# Altium project Bhishma_Slave.PrjPcb
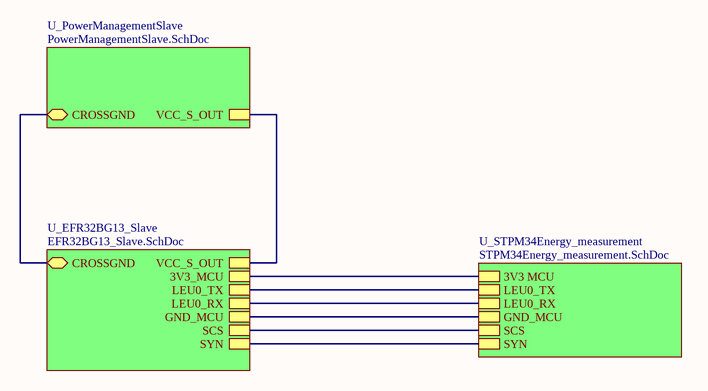
[diagram p0: Slave_Block.SchDoc]
4 sheets, 95 parts. Net scope: hierarchical (ports join the sheet entries above them; power ports are global).
Board file: Bhishma_SlaveLayout.PcbDoc
Sheets:
  Slave_Block.SchDoc
    U_EFR32BG13_Slave = EFR32BG13_Slave.SchDoc
    U_PowerManagementSlave = PowerManagementSlave.SchDoc
    U_STPM34Energy_measurement = STPM34Energy_measurement.SchDoc

## Sheet Slave_Block.SchDoc: Slave Block Diagram
size A4; Organization: University of Colorado; Address1: Boulder; Address2: Bhishma; Address3: Low Power Embedded; Address4: Design Techniques; SheetNumber: 3; SheetTotal: 9

### Sub-sheets
U_EFR32BG13_Slave = EFR32BG13_Slave.SchDoc: LEU0_TX, LEU0_RX, SCS, SYN, GND_MCU, 3V3_MCU, VCC_S_OUT, CROSSGND
U_PowerManagementSlave = PowerManagementSlave.SchDoc: VCC_S_OUT, CROSSGND
U_STPM34Energy_measurement = STPM34Energy_measurement.SchDoc: 3V3 MCU, LEU0_TX, LEU0_RX, GND_MCU, SCS, SYN

### Nets
BGND: sheet U_EFR32BG13_Slave/GND_MCU, sheet U_EFR32BG13_Slave/CROSSGND, sheet U_PowerManagementSlave/CROSSGND, sheet U_STPM34Energy_measurement/GND_MCU
IOVDD: sheet U_EFR32BG13_Slave/3V3_MCU, sheet U_STPM34Energy_measurement/3V3 MCU
PA2: sheet U_EFR32BG13_Slave/LEU0_RX, sheet U_STPM34Energy_measurement/LEU0_RX
PA3: sheet U_EFR32BG13_Slave/LEU0_TX, sheet U_STPM34Energy_measurement/LEU0_TX
PA4: sheet U_EFR32BG13_Slave/SCS, sheet U_STPM34Energy_measurement/SCS
PA5: sheet U_EFR32BG13_Slave/SYN, sheet U_STPM34Energy_measurement/SYN
NetC33_2: sheet U_EFR32BG13_Slave/VCC_S_OUT, sheet U_PowerManagementSlave/VCC_S_OUT

### Notes on the sheet
- Title
- Size:
- Date:
- A4
- Number:
- Time:
- Revision:
- Sheet
- of
- File:

## Sheet EFR32BG13_Slave.SchDoc: EFR32BG13 Blue Gecko Slave
size A4; Author: Sarthak Jain; DrawnBy: Sarthak Jain; Engineer: Sarthak Jain; Organization: University of Colorado; Address1: Boulder; Address2: Bhishma; Address3: Low Power Embedded; Address4: Design Techniques; Revision: 0.1; SheetNumber: 8; SheetTotal: 9; ProjectName: Bhishma
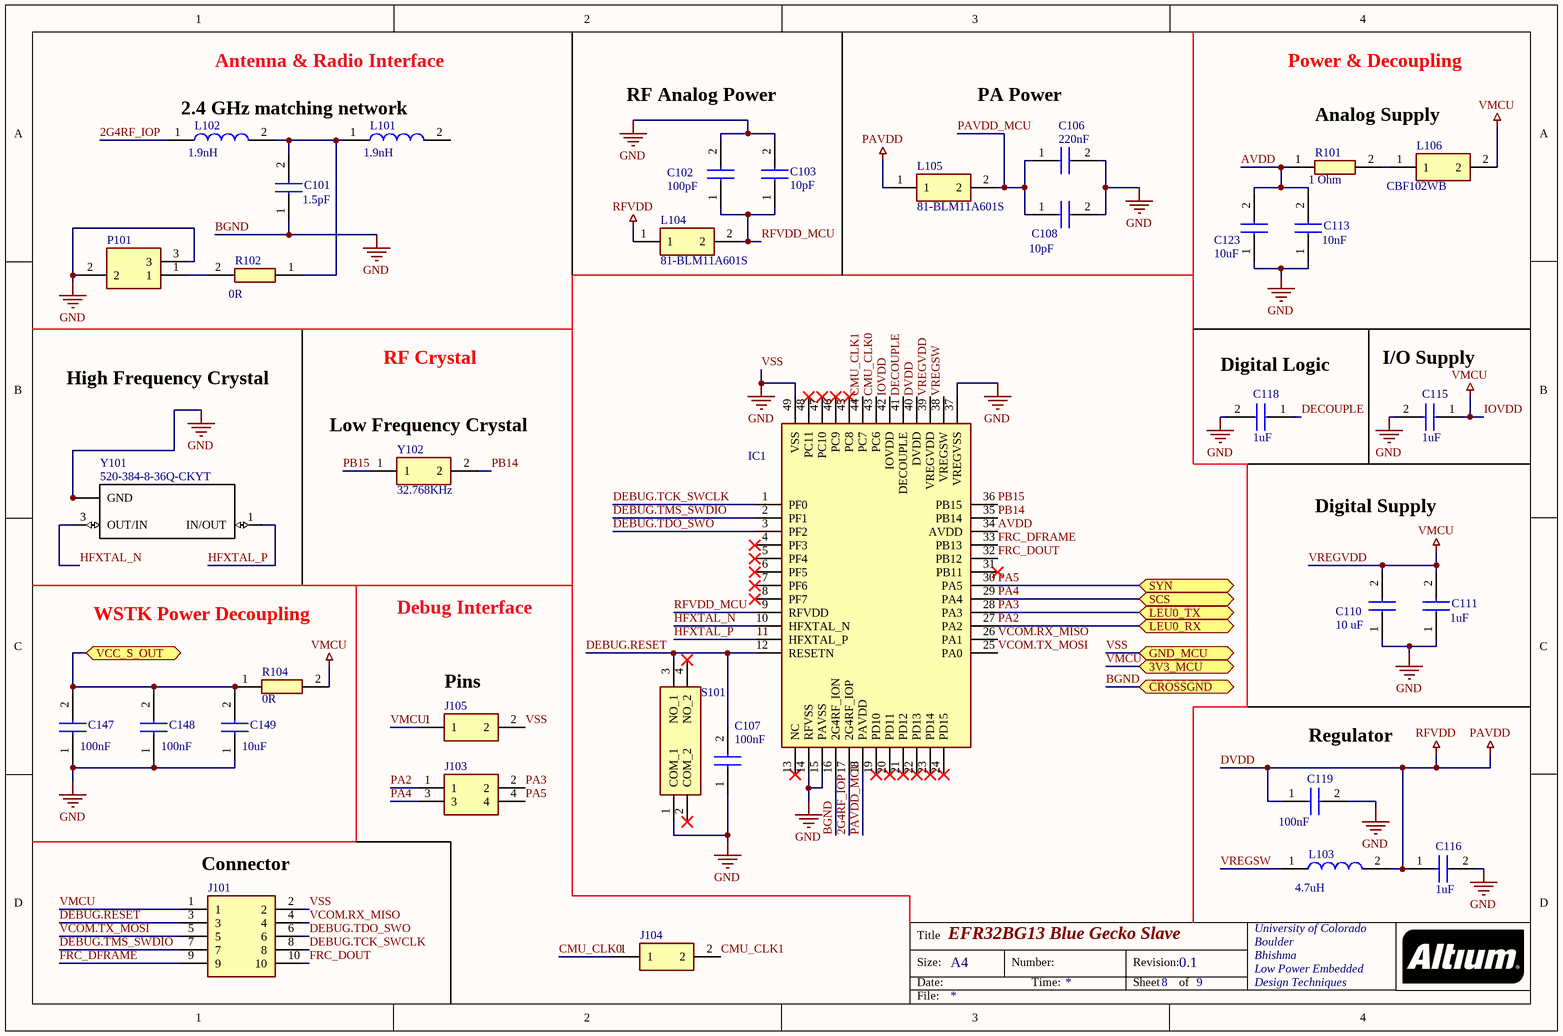
[diagram p1: EFR32BG13_Slave.SchDoc]

### Parts
C101  value 1.5pF  [CAPC1608X90N]
C102  value 100pF  [CAPC1608X90N]  (hidden comment: 81-GCG1885G1H101JA1D)
C103  value 10pF  [CAPC1608X90N]  (hidden comment: 81-GCG1885G1H100JA1D)
C106  value 220nF  [CAPC1608X90N]  (hidden comment: 81-GCM188R71E224K55D)
C107  value 100nF  [CAPC1608X90N]  (hidden comment: 581-0603YC104JAT4A)
C108  value 10pF  [CAPC1608X90N]  (hidden comment: 81-GCG1885G1H100JA1D)
C110  value 10 uF  [CAPC1608X90N]  (hidden comment: 81-GRM188R61E106KA3D)
C111  value 1uF  [CAPC1608X90N]  (hidden comment: 81-GCM188R71C105K64D)
C113  value 10nF  [CAPC1608X90N]  (hidden comment: 81-GCM1887U1H103JA6J)
C115  value 1uF  [CAPC1608X90N]  (hidden comment: 81-GCM188R71C105K64D)
C116  value 1uF  [CAPC1608X90N]  (hidden comment: 81-GCM188R71C105K64D)
C118  value 1uF  [CAPC1608X90N]  (hidden comment: 81-GCM188R71C105K64D)
C119  value 100nF  [CAPC1608X90N]  (hidden comment: 581-0603YC104JAT4A)
C123  value 10uF  [CAPC1608X90N]  (hidden comment: 81-GRM188R61E106KA3D)
C147  value 100nF  [CAPC1608X90N]  (hidden comment: 581-0603YC104JAT4A)
C148  value 100nF  [CAPC1608X90N]  (hidden comment: 581-0603YC104JAT4A)
C149  value 10uF  [CAPC1608X90N]  (hidden comment: 81-GRM188R61E106KA3D)
IC1  634-BGP632F512GM48D  [QFN50P700X700X90-49N-D]  (value not drawn)
J101  200-FTSH10501FDVK  [SAMTEC_FTSH-105-01-L-DV]  (value not drawn)
J103  538-87898-0424  [878980424]  (value not drawn)
J104  538-87898-0204  [878980204]  (value not drawn)
J105  538-87898-0204  [878980204]  (value not drawn)
L101  value 1.9nH  [LQP03TQ0N6B02D]
L102  value 1.9nH  [LQP03TQ0N6B02D]
L103  value 4.7uH  [INDC1608X95N]  (hidden comment: 810-KLZ1608MHR4R7WTD)
L104  81-BLM11A601S  [BEADC1608X95N]
L105  81-BLM11A601S  [BEADC1608X95N]
L106  value CBF102WB  [BEADC1608X100N]  (hidden comment: 710-74279266)
P101  798-U.FL-R-SMT-110  [U.FL-R-SMT-1(10)]  (value not drawn)
R101  value 1 Ohm  [RESC1608X55N]  (hidden comment: 279-CRGS0603J1R0)
R102  value 0R  [RESC3216X60N]  (hidden comment: 71-CRCW12060000Z0EAC)
R104  value 0R  [RESC3216X60N]  (hidden comment: 71-CRCW12060000Z0EAC)
S101  612-LL3301AF065QJ  [LL3301FF065QJ]  (value not drawn)
Y101  520-384-8-36Q-CKYT  [*XTAL_ECS-384-8-36Q-CKY-TR]
Y102  value 32.768KHz  [CM8V32768TA020125]  (hidden comment: 428-201410-MC01)

### Ports
3V3_MCU, CROSSGND, GND_MCU, LEU0_RX, LEU0_TX, SCS, SYN, VCC_S_OUT

### Nets
BGND: C101.1 C102.2 C103.2 C106.2 C107.1 C108.2 C110.1 C111.1 C113.1 C115.2 C116.2 C118.2 C119.2 C123.1 C147.1 C148.1 C149.1 IC1.14(RFVSS) IC1.15(PAVSS) IC1.16(2G4RF_ION) IC1.37(VREGVSS) IC1.49(VSS) J101.2 J105.2 P101.2 P101.3 S101.1(COM_1) Y101.2(GND) Y101.4(GND) ; port GND_MCU, port CROSSGND  [also labelled GND, VSS]
DVDD: C116.1 C119.1 IC1.40(DVDD) L103.2 L104.1 L105.1  [also labelled PAVDD, RFVDD]
IOVDD: C110.2 C111.2 C115.1 IC1.39(VREGVDD) IC1.42(IOVDD) J101.1 J105.1 L106.2 R104.2 ; port 3V3_MCU  [also labelled VMCU, VREGVDD]
2G4RF_IOP: IC1.17(2G4RF_IOP) L102.1
AVDD: C113.2 C123.2 IC1.34(AVDD) R101.1
CMU_CLK0: IC1.43(PC6) J104.1
CMU_CLK1: IC1.44(PC7) J104.2
DEBUG.RESET: C107.2 IC1.12(RESETN) J101.3 S101.3(NO_1)
DEBUG.TCK_SWCLK: IC1.1(PF0) J101.8
DEBUG.TDO_SWO: IC1.3(PF2) J101.6
DEBUG.TMS_SWDIO: IC1.2(PF1) J101.7
DECOUPLE: C118.1 IC1.41(DECOUPLE)
FRC_DFRAME: IC1.33(PB13) J101.9
FRC_DOUT: IC1.32(PB12) J101.10
HFXTAL_N: IC1.10(HFXTAL_N) Y101.3(OUT/IN)
HFXTAL_P: IC1.11(HFXTAL_P) Y101.1(IN/OUT)
PA2: IC1.27(PA2) J103.1 ; port LEU0_RX
PA3: IC1.28(PA3) J103.2 ; port LEU0_TX
PA4: IC1.29(PA4) J103.3 ; port SCS
PA5: IC1.30(PA5) J103.4 ; port SYN
PAVDD_MCU: C106.1 C108.1 IC1.18(PAVDD) L105.2
PB14: IC1.35(PB14) Y102.2
PB15: IC1.36(PB15) Y102.1
RFVDD_MCU: C102.1 C103.1 IC1.9(RFVDD) L104.2
VCOM.RX_MISO: IC1.26(PA1) J101.4
VCOM.TX_MOSI: IC1.25(PA0) J101.5
VREGSW: IC1.38(VREGSW) L103.1
NetC33_2: C147.2 C148.2 C149.2 R104.1 ; port VCC_S_OUT
NetC101_2: C101.2 L101.1 L102.2 R102.1
NetL106_1: L106.1 R101.2
NetP101_1: P101.1 R102.2

Not connected (* = marked no-connect by the designer): IC1 4(PF3)* 5(PF4)* 6(PF5)* 7(PF6)* 8(PF7)* 13(NC)* 19(PD10)* 20(PD11)* 21(PD12)* 22(PD13)* 23(PD14)* 24(PD15)* 31(PB11)* 45(PC8)* 46(PC9)* 47(PC10)* 48(PC11)*; L101 2; S101 2(COM_2)* 4(NO_2)*

### Notes on the sheet
- 2.4 GHz matching network
- Antenna & Radio Interface
- RF Analog Power
- PA Power
- Power & Decoupling
- Analog Supply
- High Frequency Crystal
- RF Crystal
- (near C118) Digital Logic
- (near C115) I/O Supply
- (near Y102) Low Frequency Crystal
- Digital Supply
- WSTK Power Decoupling
- Debug Interface
- (near J105) Pins
- Regulator
- (near J101) Connector
- Title
- Size:
- Date:
- A4
- Number:
- Time:
- Revision:
- Sheet
- of
- File:

### Library data of the parts
C101 = GRM1885C1H1R5CA01D: Capacitor; Manufacturer_Name: Murata Electronics; Datasheet Link: http://www.murata.com/~/media/webrenewal/support/library/catalog/products/capacitor/mlcc/c02e.pdf; Height: 0.9mm; Manufacturer_Part_Number: GRM1885C1H1R5CA01D; RS Part Number: 7769236; RS Price/Stock: https://uk.rs-online.com/web/p/products/7769236
C102 = GCG1885G1H101JA01D: Capacitor; Manufacturer_Name: Murata Electronics; Datasheet Link: https://psearch.en.murata.com/capacitor/product/GCG1885G1H101JA01%23.html; Height: 0.9mm; Manufacturer_Part_Number: GCG1885G1H101JA01D; Mouser Part Number: 81-GCG1885G1H101JA1D; Mouser Price/Stock: https://www.mouser.com/Search/Refine.aspx?Keyword=81-GCG1885G1H101JA1D
C103 C108 = GCG1885G1H100JA01D: Capacitor; Manufacturer_Name: Murata Electronics; Datasheet Link: https://psearch.en.murata.com/capacitor/product/GCG1885G1H100JA01%23.html; Height: 0.9mm; Manufacturer_Part_Number: GCG1885G1H100JA01D; Mouser Part Number: 81-GCG1885G1H100JA1D; Mouser Price/Stock: https://www.mouser.com/Search/Refine.aspx?Keyword=81-GCG1885G1H100JA1D
C106 = GCM188R71E224KA55D: Capacitor; Manufacturer_Name: Murata Electronics; Datasheet Link: https://psearch.en.murata.com/capacitor/product/GCM188R71E224KA55%23.html; Height: 0.9mm; Manufacturer_Part_Number: GCM188R71E224KA55D; Mouser Part Number: 81-GCM188R71E224K55D; Mouser Price/Stock: https://www.mouser.com/Search/Refine.aspx?Keyword=81-GCM188R71E224K55D; RS Part Number: 7234976P; RS Price/Stock: http://uk.rs-online.com/web/p/products/7234976P
C107 C119 C147 C148 = 0603YC104JAT4A: Capacitor; Manufacturer_Name: AVX; Datasheet Link: https://componentsearchengine.com/Datasheets/1/06031A100FAT2A.pdf; Height: 0.9mm; Manufacturer_Part_Number: 0603YC104JAT4A; Mouser Part Number: 581-0603YC104JAT4A; Mouser Price/Stock: https://www.mouser.com/Search/Refine.aspx?Keyword=581-0603YC104JAT4A
C110 C123 C149 = GRM188R61E106KA73D: Capacitor; Manufacturer_Name: Murata Electronics; Datasheet Link: http://componentsearchengine.com/Datasheets/1/GRM188R61E106KA73D.pdf; Height: 0.9mm; Manufacturer_Part_Number: GRM188R61E106KA73D; Mouser Part Number: 81-GRM188R61E106KA3D; Mouser Price/Stock: https://www.mouser.com/Search/Refine.aspx?Keyword=81-GRM188R61E106KA3D
C111 C115 C116 C118 = GCM188R71C105KA64D: Capacitor; Manufacturer_Name: Murata Electronics; Datasheet Link: https://psearch.en.murata.com/capacitor/product/GCM188R71C105KA64%23.html; Height: 0.9mm; Manufacturer_Part_Number: GCM188R71C105KA64D; Mouser Part Number: 81-GCM188R71C105K64D; Mouser Price/Stock: https://www.mouser.com/Search/Refine.aspx?Keyword=81-GCM188R71C105K64D; RS Part Number: 7900562P; RS Price/Stock: http://uk.rs-online.com/web/p/products/7900562P
C113 = GCM1887U1H103JA16J: Capacitor; Manufacturer_Name: Murata Electronics; Datasheet Link: https://psearch.en.murata.com/capacitor/product/GCM1887U1H103JA16%23.html; Height: 0.9mm; Manufacturer_Part_Number: GCM1887U1H103JA16J; Mouser Part Number: 81-GCM1887U1H103JA6J; Mouser Price/Stock: https://www.mouser.com/Search/Refine.aspx?Keyword=81-GCM1887U1H103JA6J
IC1 = EFR32BG13P632F512GM48-D: Integrated Circuit; Manufacturer_Name: Silicon Labs; Datasheet Link: https://componentsearchengine.com/Datasheets/1/EFR32BG13P632F512GM48-D.pdf; Height: 0.9mm; Manufacturer_Part_Number: EFR32BG13P632F512GM48-D; Mouser Part Number: 634-BGP632F512GM48D; Mouser Price/Stock: https://www.mouser.com/Search/Refine.aspx?Keyword=634-BGP632F512GM48D
J101 = FTSH-105-01-F-DV-K: Connector; Manufacturer_Name: SAMTEC; Datasheet Link: http://suddendocs.samtec.com/prints/ftsh-1xx-xx-xxx-dv-xxx-xxx-mkt.pdf; Manufacturer_Part_Number: FTSH-105-01-F-DV-K; Mouser Part Number: 200-FTSH10501FDVK; Mouser Price/Stock: https://www.mouser.com/Search/Refine.aspx?Keyword=200-FTSH10501FDVK; RS Part Number: 1592372; RS Price/Stock: http://uk.rs-online.com/web/p/products/1592372
J103 = 87898-0424: Connector; Manufacturer_Name: Molex; Allied_Number: 71465829; Datasheet Link: https://componentsearchengine.com/Datasheets/1/87898-0424.pdf; Height: 9.65mm; Manufacturer_Part_Number: 87898-0424; Mouser Part Number: 538-87898-0424; Mouser Price/Stock: https://www.mouser.com/Search/Refine.aspx?Keyword=538-87898-0424; Allied Price/Stock: https://www.alliedelec.com/molexincorporated-87898-0424/71465829/
J104 J105 = 87898-0204: Connector; Manufacturer_Name: Molex; Allied_Number: 70967354; Datasheet Link: https://www.molex.com/pdm_docs/sd/878980204_sd.pdf; Height: 8.33mm; Manufacturer_Part_Number: 87898-0204; Mouser Part Number: 538-87898-0204; Mouser Price/Stock: https://www.mouser.com/Search/Refine.aspx?Keyword=538-87898-0204; Allied Price/Stock: https://www.alliedelec.com/molex-incorporated-87898-0204/70967354/
L101 L102 = LQP03TQ1N9C02D: Inductor; Manufacturer_Name: Murata Electronics; Datasheet Link: https://psearch.en.murata.com/inductor/product/LQP03TQ1N9C02%23.html; Height: 0.6mm; Manufacturer_Part_Number: LQP03TQ1N9C02D
L103 = KLZ1608MHR4R7WTD25: Inductor; Manufacturer_Name: TDK; Datasheet Link: http://www.mouser.com/datasheet/2/400/nductor_automotive_decoupling_klz1608-hr_en-1108665.pdf; Height: 0.95mm; Manufacturer_Part_Number: KLZ1608MHR4R7WTD25; Mouser Part Number: 810-KLZ1608MHR4R7WTD; Mouser Price/Stock: https://www.mouser.com/Search/Refine.aspx?Keyword=810-KLZ1608MHR4R7WTD
L104 L105 = BLM18AG601SN1D: Filter; Manufacturer_Name: Murata Electronics; Datasheet Link: https://www.murata.com/en-us/products/productdetail?partno=BLM18AG601SN1%23; Height: 0.95mm; Manufacturer_Part_Number: BLM18AG601SN1D; Mouser Part Number: 81-BLM11A601S; Mouser Price/Stock: https://www.mouser.com/Search/Refine.aspx?Keyword=81-BLM11A601S; RS Part Number: 0110380; RS Price/Stock: http://uk.rs-online.com/web/p/products/0110380
L106 = 74279266: Ferrite Bead; Manufacturer_Name: Wurth Elektronik; Datasheet Link: http://uk.rs-online.com/web/p/products/3674856; Height: 1mm; Manufacturer_Part_Number: 74279266; Mouser Part Number: 710-74279266; Mouser Price/Stock: https://www.mouser.com/Search/Refine.aspx?Keyword=710-74279266; RS Part Number: 1241858P; RS Price/Stock: http://uk.rs-online.com/web/p/products/1241858P
P101 = U.FL-R-SMT-1(10): Connector; Manufacturer_Name: Hirose; Datasheet Link: https://www.hirose.com/product/en/download_file/key_name/U.FL-R-SMT-1%2810%29/category/Drawing%20(2D)/doc_file_id/37627/?file_category_id=6&item_id=03310472210&is_series=; Manufacturer_Part_Number: U.FL-R-SMT-1(10); Mouser Part Number: 798-U.FL-R-SMT-110; Mouser Price/Stock: https://www.mouser.com/Search/Refine.aspx?Keyword=798-U.FL-R-SMT-110; RS Part Number: 0557981; RS Price/Stock: http://uk.rs-online.com/web/p/products/0557981
R101 = CRGS0603J1R0: Resistor; Manufacturer_Name: TE Connectivity; Datasheet Link: http://www.te.com/commerce/DocumentDelivery/DDEController?Action=showdoc&DocId=Data+Sheet%7F9-1773463-8%7FB%7Fpdf%7FEnglish%7FENG_DS_9-1773463-8_B.pdf%7F3-2176243-7; Height: 0.55mm; Manufacturer_Part_Number: CRGS0603J1R0; Mouser Part Number: 279-CRGS0603J1R0; Mouser Price/Stock: https://www.mouser.com/Search/Refine.aspx?Keyword=279-CRGS0603J1R0; RS Part Number: 9044983P; RS Price/Stock: http://uk.rs-online.com/web/p/products/9044983P
R102 R104 = CRCW12060000Z0EAC: Resistor; Manufacturer_Name: Vishay; Datasheet Link: http://componentsearchengine.com/Datasheets/1/CRCW12060000Z0EAC.pdf; Height: 0.6mm; Manufacturer_Part_Number: CRCW12060000Z0EAC; Mouser Part Number: 71-CRCW12060000Z0EAC; Mouser Price/Stock: https://www.mouser.com/Search/Refine.aspx?Keyword=71-CRCW12060000Z0EAC
S101 = LL3301AF065QJ: Switch; Manufacturer_Name: E-Switch; Datasheet Link: https://media.digikey.com/pdf/Data%20Sheets/E-Switch%20PDFs/LL3301AF065QJ.pdf; Height: 7.3mm; Manufacturer_Part_Number: LL3301AF065QJ; Mouser Part Number: 612-LL3301AF065QJ; Mouser Price/Stock: https://www.mouser.com/Search/Refine.aspx?Keyword=612-LL3301AF065QJ
Y101 = ECS-384-8-36Q-CKY-TR: Crystal 38.4mhz 8pf Smd; Manufacturer_Name: ECS Inc.; Package: SMD-4 ECS International; Availability: Unavailable; SnapEDA_Link: https://www.snapeda.com/parts/ECS-384-8-36Q-CKY-TR/ECS%20Inc./view-part/?ref=snap; Price: None; Manufacturer_Part_Number: ECS-384-8-36Q-CKY-TR; Value: *; Mouser Part Number: 520-384-8-36Q-CKYT; Mouser Price/Stock: https://www.mouser.com/ProductDetail/ECS/ECS-384-8-36Q-CKY-TR?qs=%2Fha2pyFaduieYLvRCOUxDiycX6RSF1FiuS1QhwWyXzrQsIptGqg3hkPASiWtTF8J
Y102 = CM8V-T1A-32.768kHz-9pF-20PPM-TA-QC: Crystal or Oscillator; Manufacturer_Name: MICRO CRYSTAL; Datasheet Link: https://www.mouser.co.uk/datasheet/2/530/cm8v-t1a-1085761.pdf; Manufacturer_Part_Number: CM8V-T1A-32.768kHz-9pF-20PPM-TA-QC; Mouser Part Number: 428-201410-MC01; Mouser Price/Stock: https://www.mouser.com/Search/Refine.aspx?Keyword=428-201410-MC01

## Sheet PowerManagementSlave.SchDoc: LTC3550 Power Management - Slave
size A4; Author: Hardik Senjaliya; DrawnBy: Hardik Senjaliya; Engineer: Hardik Senjaliya; Organization: University of Colorado; Address1: Boulder; Address2: Bhishma; Address3: Low Power Embedded; Address4: Design Techniques; Revision: 0.1; SheetNumber: 7; SheetTotal: 9; ProjectName: Bhishma
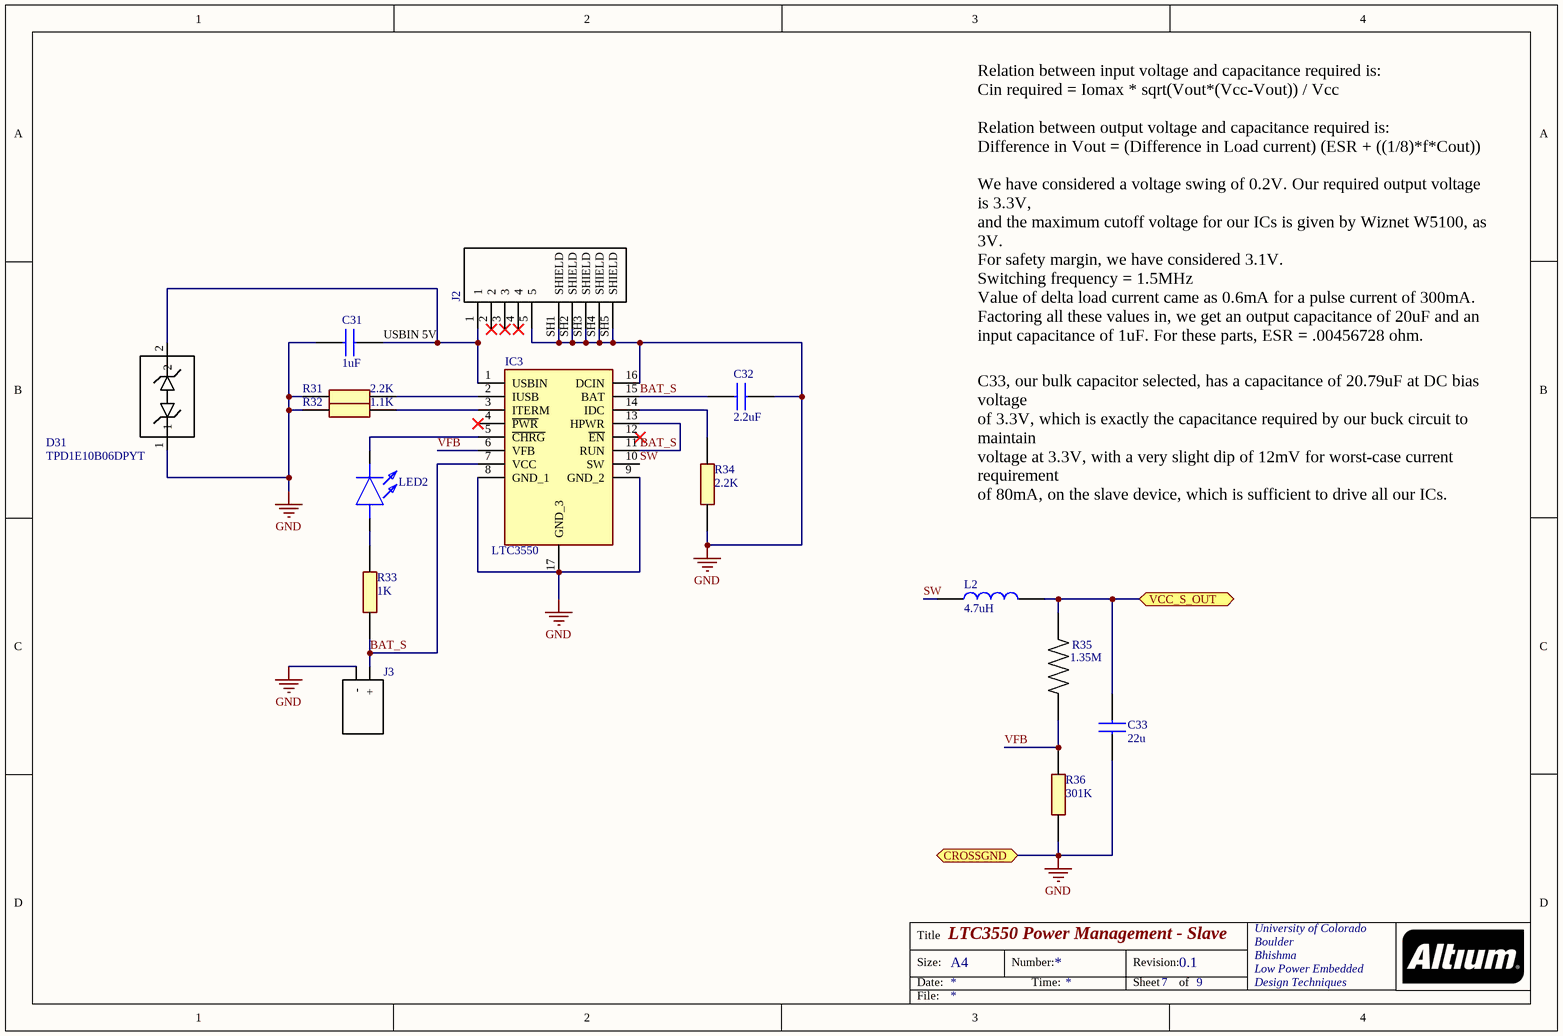
[diagram p2: PowerManagementSlave.SchDoc]

### Parts
C31  value 1uF  [CAPC1608X90N]  (hidden comment: 81-GCM188R71C105K64D)
C32  value 2.2uF  [CAPC1608X90N]  (hidden comment: 81-GRM188C71E225KE1J)
C33  value 22u  [CAPC1608X90N]  (hidden comment: 581-06036D226MAT2A)
D31  value TPD1E10B06DPYT  [*DFN100X60X45-2N]  (hidden comment: 595-TPD1E10B06DPYT)
IC3  value LTC3550  [SON50P300X500X85-17N-D]  (hidden comment: 584-LTC3550EDHC#PBF)
J2  490-UJ2-MIBH2-4-SMT  [*CUI_UJ2-MIBH2-4-SMT-TR_UJ2-MIBH2-4-SMT-TR(Primary)]  (value not drawn)
J3  710-691508110302  [691508110302]  (value not drawn)
L2  value 4.7uH  [INDPM6060X300N]  (hidden comment: 810-SLF6028T-4R7M)
LED2  630-HSMC-C190  [LEDC1608X90N]  (value not drawn)
R31  value 2.2K  [RESC1608X55N]  (hidden comment: 594-MCT06030D2201BP1)
R32  value 1.1K  [RESC1608X55N]  (hidden comment: 667-ERA-3ARB112V)
R33  value 1K  [RESC1608X55N]  (hidden comment: 594-MCT0603MD1001BP5)
R34  value 2.2K  [RESC1608X55N]  (hidden comment: 594-MCT06030D2201BP1)
R35  value 1.35M  [*RESC3216X65N]  (hidden comment: 71-TNPW12061M35BEEN)
R36  value 301K  [RESC1608X55N]  (hidden comment: 667-ERA-3AEB3013V)

### Ports
CROSSGND, VCC_S_OUT

### Nets
GND: C31.1 C32.2 C33.1 D31.1 IC3.8(GND_1) IC3.9(GND_2) IC3.16(DCIN) IC3.17(GND_3) J2.5 J2.SH1(SHIELD) J2.SH2(SHIELD) J2.SH3(SHIELD) J2.SH4(SHIELD) J2.SH5(SHIELD) J3.1(-) R31.1 R32.1 R34.2 R36.1 ; port CROSSGND  [project net BGND]
BAT_S: C32.1 IC3.7(VCC) IC3.11(RUN) IC3.13(HPWR) IC3.15(BAT) J3.2(+) R33.1
SW: IC3.10(SW) L2.1
VFB: IC3.6(VFB) R35.1 R36.2
NetC31_2: C31.2 D31.2 IC3.1(USBIN) J2.1
NetC33_2: C33.2 L2.2 R35.2 ; port VCC_S_OUT
NetIC3_2: IC3.2(IUSB) R31.2
NetIC3_3: IC3.3(ITERM) R32.2
NetIC3_5: IC3.5(~{CHRG}) LED2.1(K)
NetIC3_14: IC3.14(IDC) R34.1
NetLED2_2: LED2.2(A) R33.2

Not connected (* = marked no-connect by the designer): IC3 4(~{PWR})* 12(~{EN})*; J2 2* 3* 4*

### Notes on the sheet
- (near C31) USBIN 5V
- Relation between input voltage and capacitance required is:
  Cin required = Iomax * sqrt(Vout*(Vcc-Vout)) / Vcc
  Relation between output voltage and capacitance required is:
  Difference in Vout = (Difference in Load current) (ESR + ((1/8)*f*Cout))
  We have considered a voltage swing of 0.2V. Our required output voltage is 3.3V,
  and the maximum cutoff voltage for our ICs is given by Wiznet W5100, as 3V.
  For safety margin, we have considered 3.1V.
  Switching frequency = 1.5MHz
  Value of delta load current came as 0.6mA for a pulse current of 300mA.
  Factoring all these values in, we get an output capacitance of 20uF and an
  input capacitance of 1uF. For these parts, ESR = .00456728 ohm.
- C33, our bulk capacitor selected, has a capacitance of 20.79uF at DC bias voltage
  of 3.3V, which is exactly the capacitance required by our buck circuit to maintain
  voltage at 3.3V, with a very slight dip of 12mV for worst-case current requirement
  of 80mA, on the slave device, which is sufficient to drive all our ICs.
- Title
- Size:
- Date:
- A4
- Number:
- Time:
- Revision:
- Sheet
- of
- File:

### Library data of the parts
C31 = GCM188R71C105KA64D: as C111 on sheet EFR32BG13_Slave; Datasheet Link: https://psearch.en.murata.com/capacitor/product/GCM188R71C105KA64%23.html; Height: 0.9mm; Manufacturer_Part_Number: GCM188R71C105KA64D; Mouser Part Number: 81-GCM188R71C105K64D; Mouser Price/Stock: https://www.mouser.com/Search/Refine.aspx?Keyword=81-GCM188R71C105K64D; RS Part Number: 7900562P; RS Price/Stock: http://uk.rs-online.com/web/p/products/7900562P
C32 = GRM188C71E225KE11J: Capacitor; Manufacturer_Name: Murata Electronics; Datasheet Link: https://psearch.en.murata.com/capacitor/product/GRM188C71E225KE11%23.html; Height: 0.9mm; Manufacturer_Part_Number: GRM188C71E225KE11J; Mouser Part Number: 81-GRM188C71E225KE1J; Mouser Price/Stock: https://www.mouser.com/Search/Refine.aspx?Keyword=81-GRM188C71E225KE1J
C33 = 06036D226MAT2A: Capacitor; Manufacturer_Name: AVX; Datasheet Link: https://componentsearchengine.com/Datasheets/1/06031A100FAT2A.pdf; Height: 0.9mm; Manufacturer_Part_Number: 06036D226MAT2A; Mouser Part Number: 581-06036D226MAT2A; Mouser Price/Stock: https://www.mouser.com/Search/Refine.aspx?Keyword=581-06036D226MAT2A
D31 = TPD1E10B06DPYT: Single-Channel ESD in 0402 Package With 10pF Capacitance and 6V Breakdown 2-X1SON -40 to 125; Manufacturer_Name: Texas Instruments; Package: XDFN-2 Texas Instruments; Manufacturer_Part_Number: TPD1E10B06DPYT; Availability: Unavailable; SnapEDA_Link: https://www.snapeda.com/parts/TPD1E10B06DPYT/Texas%20Instruments/view-part/?ref=snap; Price: None; Mouser_Part_Number: 595-TPD1E10B06DPYT; Datasheet Link: www.ti.com/lit/ds/symlink/tpd1e10b06.pdf
IC3 = LTC3550EDHC#PBF: Integrated Circuit; Manufacturer_Name: Linear Technology; Datasheet Link: https://www.analog.com/media/en/technical-documentation/data-sheets/3550fa.pdf; Height: 0.85mm; Manufacturer_Part_Number: LTC3550EDHC#PBF; Mouser Part Number: 584-LTC3550EDHC#PBF; Mouser Price/Stock: https://www.mouser.com/Search/Refine.aspx?Keyword=584-LTC3550EDHC%23PBF
J2 = UJ2-MIBH2-4-SMT-TR: Micro B, USB 2.0, 1.8 A, Right Angle, Surface Mount _SMT_, USB Receptacle; Manufacturer_Name: CUI Devices; Mouser Part Number: 490-UJ2-MIBH2-4-SMT; Package: None; SnapEDA_Link: https://www.snapeda.com/parts/UJ2-MIBH2-4-SMT-TR/CUI%20Devices/view-part/?ref=snap; CUI_purchase_URL: https://www.cuidevices.com/product/interconnect/connectors/usb-connectors/uj2-mibh2-4-smt?utm_source=snapeda.com&utm_medium=referral&utm_campaign=snapedaBOM; Manufacturer_Part_Number: UJ2-MIBH2-4-SMT-TR; Value: UJ2-MIBH2-4-SMT-TR; Datasheet Link: https://www.mouser.com/datasheet/2/670/uj2-mibh2-4-smt-1313423.pdf
J3 = 691508110302: 5081 Series 3.5mm Pitch Horizontal, PCBTerminal Block, Surface Mount, 2 Way; Manufacturer_Name: Wurth Electronics; Manufacturer_Part_Number: 691508110302; Datasheet Link: https://www.mouser.com/datasheet/2/445/6915081103xx-469297.pdf; Mouser Part Number: 710-691508110302; Value: *
L2 = SLF6028T-4R7M1R6-PF: Inductor; Manufacturer_Name: TDK; Datasheet Link: https://product.tdk.com/info/en/document/catalog/smd/inductor_commercial_power_slf6028_en.pdf; Height: 3mm; Manufacturer_Part_Number: SLF6028T-4R7M1R6-PF; Mouser Part Number: 810-SLF6028T-4R7M; Mouser Price/Stock: https://www.mouser.com/Search/Refine.aspx?Keyword=810-SLF6028T-4R7M; RS Part Number: 7413399P; RS Price/Stock: http://uk.rs-online.com/web/p/products/7413399P
LED2 = HSMC-C190: LED; Manufacturer_Name: Avago Technologies; Datasheet Link: http://www.mouser.hk/ProductDetail/Broadcom-Avago/HSMC-C190/?qs=YDL0qNrpDT4TTmzDJNXHWQ==; Height: 0.9mm; Manufacturer_Part_Number: HSMC-C190; Mouser Part Number: 630-HSMC-C190; Mouser Price/Stock: https://www.mouser.com/Search/Refine.aspx?Keyword=630-HSMC-C190; RS Part Number: 6910391P; RS Price/Stock: http://uk.rs-online.com/web/p/products/6910391P
R31 R34 = MCT06030D2201BP100: Resistor; Manufacturer_Name: Vishay; Allied_Number: 70398207; Datasheet Link: http://www.vishay.com/docs/28705/mcx0x0xpro.pdf; Height: 0.55mm; Manufacturer_Part_Number: MCT06030D2201BP100; Mouser Part Number: 594-MCT06030D2201BP1; Mouser Price/Stock: https://www.mouser.com/Search/Refine.aspx?Keyword=594-MCT06030D2201BP1; RS Part Number: 6845474; RS Price/Stock: https://uk.rs-online.com/web/p/products/6845474; Allied Price/Stock: https://www.alliedelec.com/vishay-dale-mct06030d2201bp100/70398207/
R32 = ERA-3ARB112V: Resistor; Manufacturer_Name: Panasonic; Datasheet Link: https://industrial.panasonic.com/cdbs/www-data/pdf/RDM0000/AOA0000C307.pdf; Height: 0.55mm; Manufacturer_Part_Number: ERA-3ARB112V; Mouser Part Number: 667-ERA-3ARB112V; Mouser Price/Stock: https://www.mouser.com/Search/Refine.aspx?Keyword=667-ERA-3ARB112V
R33 = MCT0603MD1001BP500: Resistor; Manufacturer_Name: Vishay; Datasheet Link: http://www.vishay.com/docs/28705/mcx0x0xpro.pdf; Height: 0.55mm; Manufacturer_Part_Number: MCT0603MD1001BP500; Mouser Part Number: 594-MCT0603MD1001BP5; Mouser Price/Stock: https://www.mouser.com/Search/Refine.aspx?Keyword=594-MCT0603MD1001BP5
R35 = TNPW12061M35BETA: Res Thin Film 1206 1.35M Ohm 0.1% 0.25W_1/4W_ Â±25ppm/C Molded SMD Paper T/R; Manufacturer_Name: Vishay; Package: 3216 Rohm Semiconductor; Manufacturer_Part_Number: TNPW12061M35BEEN; Availability: Unavailable; SnapEDA_Link: https://www.snapeda.com/parts/TNPW12061M35BETA/Vishay/view-part/?ref=snap; Price: None; Mouser Part Number: 71-TNPW12061M35BEEN; Datasheet Link: https://www.mouser.com/datasheet/2/427/tnpw_e3-470510.pdf
R36 = ERA-3AEB3013V: Resistor; Manufacturer_Name: Panasonic; Datasheet Link: https://industrial.panasonic.com/cdbs/www-data/pdf/RDM0000/AOA0000C307.pdf; Height: 0.55mm; Manufacturer_Part_Number: ERA-3AEB3013V; Mouser Part Number: 667-ERA-3AEB3013V; Mouser Price/Stock: https://www.mouser.com/Search/Refine.aspx?Keyword=667-ERA-3AEB3013V

## Sheet STPM34Energy_measurement.SchDoc: STPM34 Power Measurement
size A4; Author: Vatsal Sheth; DrawnBy: Vatsal Sheth; Engineer: Vatsal Sheth; Organization: University of Colorado; Address1: Boulder; Address2: Bhishma; Address3: Low Power Embedded; Address4: Design Techniques; Revision: 0.1; SheetNumber: 9; SheetTotal: 9; ProjectName: Bhishma
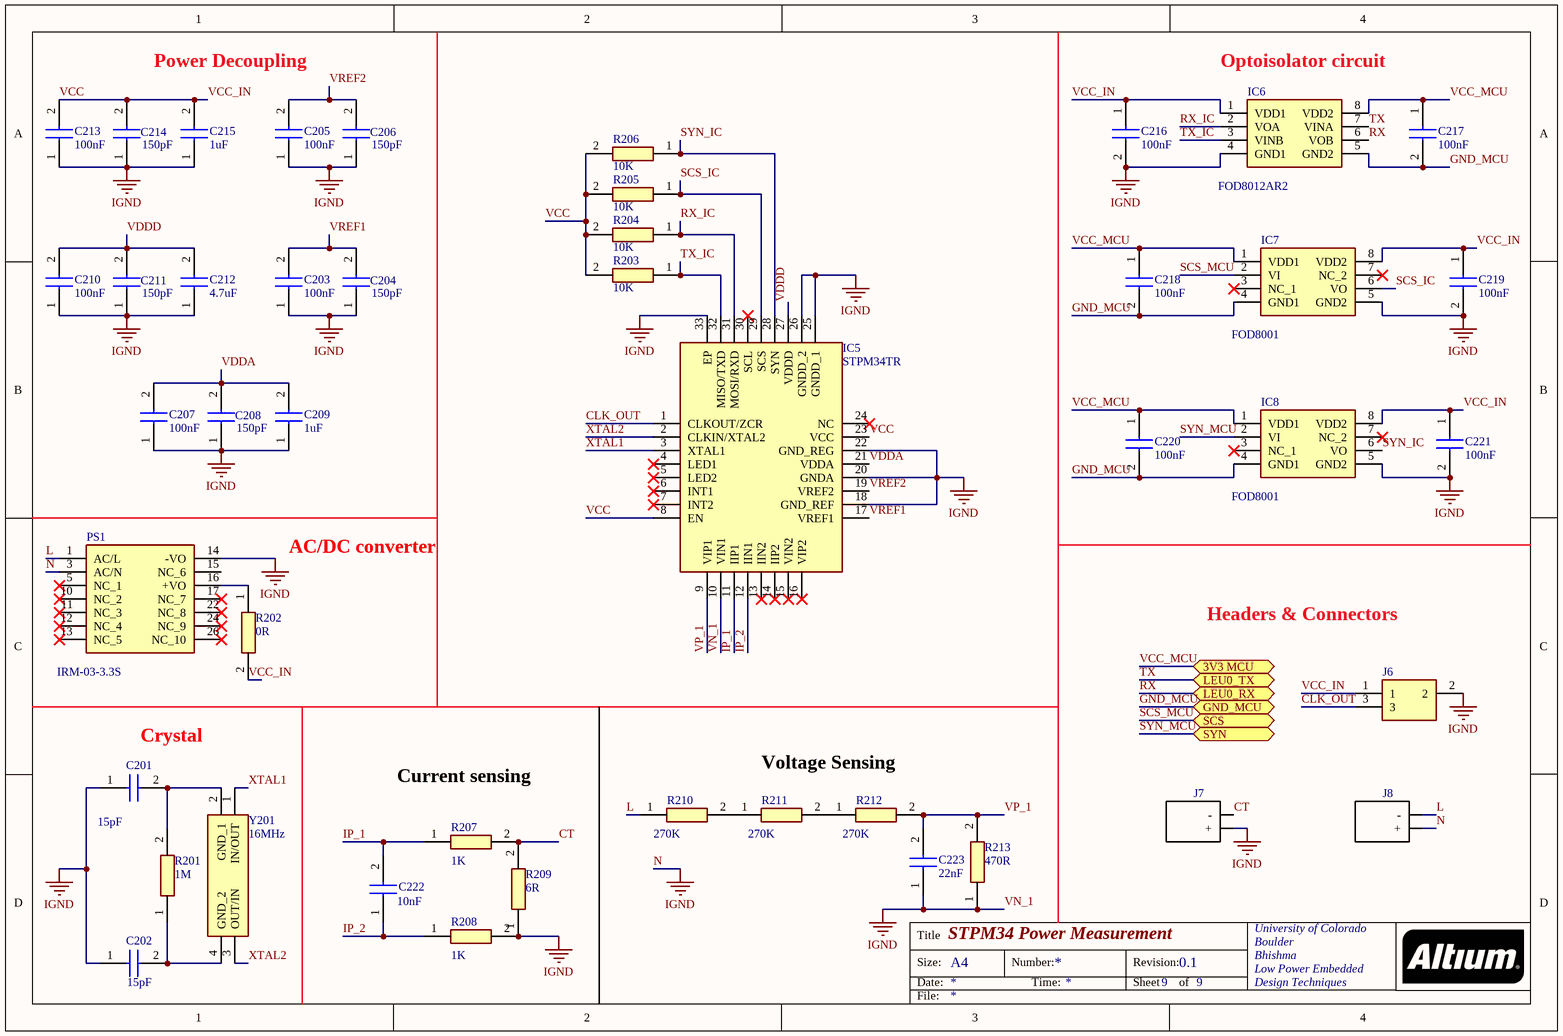
[diagram p3: STPM34Energy_measurement.SchDoc]

### Parts
C201  value 15pF  [CAPC1608X87N]  (hidden comment: 80-C0603C150F5GACTU)
C202  value 15pF  [CAPC1608X87N]  (hidden comment: 80-C0603C150F5GACTU)
C203  value 100nF  [CAPC1608X90N]  (hidden comment: 581-0603YC104JAT4A)
C204  value 150pF  [CAPC1608X87N]  (hidden comment: 80-C0603C151J4G)
C205  value 100nF  [CAPC1608X90N]  (hidden comment: 581-0603YC104JAT4A)
C206  value 150pF  [CAPC1608X87N]  (hidden comment: 80-C0603C151J4G)
C207  value 100nF  [CAPC1608X90N]  (hidden comment: 581-0603YC104JAT4A)
C208  value 150pF  [CAPC1608X87N]  (hidden comment: 80-C0603C151J4G)
C209  value 1uF  [CAPC1608X90N]  (hidden comment: 81-GCM188R71C105K64D)
C210  value 100nF  [CAPC1608X90N]  (hidden comment: 581-0603YC104JAT4A)
C211  value 150pF  [CAPC1608X87N]  (hidden comment: 80-C0603C151J4G)
C212  value 4.7uF  [CAPC1608X90N]  (hidden comment: 81-GRM188R61C475KAJD)
C213  value 100nF  [CAPC1608X90N]  (hidden comment: 581-0603YC104JAT4A)
C214  value 150pF  [CAPC1608X87N]  (hidden comment: 80-C0603C151J4G)
C215  value 1uF  [CAPC1608X90N]  (hidden comment: 81-GCM188R71C105K64D)
C216  value 100nF  [CAPC1608X90N]  (hidden comment: 581-0603YC104JAT4A)
C217  value 100nF  [CAPC1608X90N]  (hidden comment: 581-0603YC104JAT4A)
C218  value 100nF  [CAPC1608X90N]  (hidden comment: 581-0603YC104JAT4A)
C219  value 100nF  [CAPC1608X90N]  (hidden comment: 581-0603YC104JAT4A)
C220  value 100nF  [CAPC1608X90N]  (hidden comment: 581-0603YC104JAT4A)
C221  value 100nF  [CAPC1608X90N]  (hidden comment: 581-0603YC104JAT4A)
C222  value 10nF  [CAPC1608X90N]  (hidden comment: 81-GCM1887U1H103JA6J)
C223  value 22nF  [CAPC1608X90N]  (hidden comment: 81-GRM1887U1A223JA1D)
IC5  value STPM34TR  [QFN50P500X500X100-33N-D]  (hidden comment: 511-STPM34TR)
IC6  value FOD8012AR2  [SOIC127P594X363-8N]  (hidden comment: 512-FOD8012AR2)
IC7  value FOD8001  [SOIC127P594X363-8N]  (hidden comment: 512-FOD8001)
IC8  value FOD8001  [SOIC127P594X363-8N]  (hidden comment: 512-FOD8001)
J6  538-87898-0306  [878980306]  (value not drawn)
J7  710-691508110302  [691508110302]  (value not drawn)
J8  710-691508110302  [691508110302]  (value not drawn)
PS1  value IRM-03-3.3S  [IRM035S]  (hidden comment: 709-IRM03-3.3S)
R201  value 1M  [RESC1608X55N]  (hidden comment: 594-MCT06030C1004FP5)
R202  value 0R  [RESC3216X60N]  (hidden comment: 71-CRCW12060000Z0EAC)
R203  value 10K  [RESC1608X55N]  (hidden comment: 594-MCT0603MD1002BP5)
R204  value 10K  [RESC1608X55N]  (hidden comment: 594-MCT0603MD1002BP5)
R205  value 10K  [RESC1608X55N]  (hidden comment: 594-MCT0603MD1002BP5)
R206  value 10K  [RESC1608X55N]  (hidden comment: 594-MCT0603MD1002BP5)
R207  value 1K  [RESC1608X55N]  (hidden comment: 594-MCT0603PD1001DP5)
R208  value 1K  [RESC1608X55N]  (hidden comment: 594-MCT0603PD1001DP5)
R209  value 6R  [RESC1608X55N]  (hidden comment: 279-CPF0603B5R9E1)
R210  value 270K  [RESC1608X55N]  (hidden comment: 594-MCT06030C2703FP5)
R211  value 270K  [RESC1608X55N]  (hidden comment: 594-MCT06030C2703FP5)
R212  value 270K  [RESC1608X55N]  (hidden comment: 594-MCT06030C2703FP5)
R213  value 470R  [RESC1608X55N]  (hidden comment: 667-ERA-3APB471V)
Y201  value 16MHz  [ECS240836QAESTR]  (hidden comment: 520-160-8-36B-CKYT)

### Ports
3V3 MCU, GND_MCU, LEU0_RX, LEU0_TX, SCS, SYN

### Nets
GND_MCU: C217.2 C218.2 C220.2 IC6.5(GND2) IC7.4(GND1) IC8.4(GND1) ; port GND_MCU  [project net BGND]
N: C201.1 C202.1 C203.1 C204.1 C205.1 C206.1 C207.1 C208.1 C209.1 C210.1 C211.1 C212.1 C213.1 C214.1 C215.1 C216.2 C219.2 C221.2 C223.1 IC5.10(VIN1) IC5.18(GND_REF) IC5.20(GNDA) IC5.22(GND_REG) IC5.25(GNDD_1) IC5.26(GNDD_2) IC5.33(EP) IC6.4(GND1) IC7.5(GND2) IC8.5(GND2) J6.2 J7.2(+) J8.2(+) PS1.3(AC/N) PS1.14(-VO) R208.2 R209.1 R213.1  [also labelled IGND, VN_1]
VCC_MCU: C217.1 C218.1 C220.1 IC6.8(VDD2) IC7.1(VDD1) IC8.1(VDD1) ; port 3V3 MCU  [project net IOVDD]
CLK_OUT: IC5.1(CLKOUT/ZCR) J6.3
CT: J7.1(-) R207.2 R209.2
IP_1: C222.2 IC5.11(IIP1) R207.1
IP_2: C222.1 IC5.12(IIN1) R208.1
L: J8.1(-) PS1.1(AC/L) R210.1
RX: IC6.6(VOB) ; port LEU0_RX  [project net PA2]
RX_IC: IC5.31(MOSI/RXD) IC6.2(VOA) R204.1
SCS_IC: IC5.29(SCS) IC7.6(VO) R205.1
SCS_MCU: IC7.2(VI) ; port SCS  [project net PA4]
SYN_IC: IC5.28(SYN) IC8.6(VO) R206.1
SYN_MCU: IC8.2(VI) ; port SYN  [project net PA5]
TX: IC6.7(VINA) ; port LEU0_TX  [project net PA3]
TX_IC: IC5.32(MISO/TXD) IC6.3(VINB) R203.1
VCC: C213.2 C214.2 C215.2 C216.1 C219.1 C221.1 IC5.8(EN) IC5.23(VCC) IC6.1(VDD1) IC7.8(VDD2) IC8.8(VDD2) J6.1 R202.2 R203.2 R204.2 R205.2 R206.2  [also labelled VCC_IN]
VDDA: C207.2 C208.2 C209.2 IC5.21(VDDA)
VDDD: C210.2 C211.2 C212.2 IC5.27(VDDD)
VP_1: C223.2 IC5.9(VIP1) R212.2 R213.2
VREF1: C203.2 C204.2 IC5.17(VREF1)
VREF2: C205.2 C206.2 IC5.19(VREF2)
XTAL1: IC5.3(XTAL1) Y201.1(IN/OUT)
XTAL2: IC5.2(CLKIN/XTAL2) Y201.3(OUT/IN)
NetC201_2: C201.2 R201.2 Y201.2(GND_1)
NetC202_2: C202.2 R201.1 Y201.4(GND_2)
NetPS1_16: PS1.16(+VO) R202.1
NetR210_2: R210.2 R211.1
NetR211_2: R211.2 R212.1

Not connected (* = marked no-connect by the designer): IC5 4(LED1)* 5(LED2)* 6(INT1)* 7(INT2)* 13(IIN2)* 14(IIP2)* 15(VIN2)* 16(VIP2)* 24(NC)* 30(SCL)*; IC7 3(NC_1)* 7(NC_2)*; IC8 3(NC_1)* 7(NC_2)*; PS1 5(NC_1)* 10(NC_2)* 11(NC_3)* 12(NC_4)* 13(NC_5)* 15(NC_6) 17(NC_7)* 22(NC_8)* 24(NC_9)* 26(NC_10)*

### Notes on the sheet
- Power Decoupling
- Optoisolator circuit
- AC/DC converter
- Headers & Connectors
- (near C201) Crystal
- Current sensing
- Voltage Sensing
- Title
- Size:
- Date:
- A4
- Number:
- Time:
- Revision:
- Sheet
- of
- File:

### Library data of the parts
C201 C202 = C0603C150F5GACTU: Capacitor; Manufacturer_Name: Kemet; Datasheet Link: https://content.kemet.com/datasheets/KEM_C1003_C0G_SMD.pdf; Height: 0.87mm; Manufacturer_Part_Number: C0603C150F5GACTU; Mouser Part Number: 80-C0603C150F5GACTU; Mouser Price/Stock: https://www.mouser.com/Search/Refine.aspx?Keyword=80-C0603C150F5GACTU
C203 C205 C207 C210 C213 C216-C221 = 0603YC104JAT4A: Capacitor; Manufacturer_Name: AVX; Datasheet Link: https://componentsearchengine.com/Datasheets/1/06031A100FAT2A.pdf; Height: 0.9mm; Manufacturer_Part_Number: 0603YC104JAT4A; Mouser Part Number: 581-0603YC104JAT4A; Mouser Price/Stock: https://www.mouser.com/Search/Refine.aspx?Keyword=581-0603YC104JAT4A
C204 C206 C208 C211 C214 = C0603C151J4GACTU: Capacitor; Manufacturer_Name: Kemet; Datasheet Link: https://content.kemet.com/datasheets/KEM_C1003_C0G_SMD.pdf; Height: 0.87mm; Manufacturer_Part_Number: C0603C151J4GACTU; Mouser Part Number: 80-C0603C151J4G; Mouser Price/Stock: https://www.mouser.com/Search/Refine.aspx?Keyword=80-C0603C151J4G
C209 C215 = GCM188R71C105KA64D: as C111 on sheet EFR32BG13_Slave; Datasheet Link: https://psearch.en.murata.com/capacitor/product/GCM188R71C105KA64%23.html; Height: 0.9mm; Manufacturer_Part_Number: GCM188R71C105KA64D; Mouser Part Number: 81-GCM188R71C105K64D; Mouser Price/Stock: https://www.mouser.com/Search/Refine.aspx?Keyword=81-GCM188R71C105K64D; RS Part Number: 7900562P; RS Price/Stock: http://uk.rs-online.com/web/p/products/7900562P
C212 = GRM188R61C475KAAJD: Capacitor; Manufacturer_Name: Murata Electronics; Datasheet Link: http://www.murata.com/~/media/webrenewal/support/library/catalog/products/capacitor/mlcc/c02e.pdf; Height: 0.9mm; Manufacturer_Part_Number: GRM188R61C475KAAJD; Mouser Part Number: 81-GRM188R61C475KAJD; Mouser Price/Stock: https://www.mouser.com/Search/Refine.aspx?Keyword=81-GRM188R61C475KAJD; RS Part Number: 8847264; RS Price/Stock: https://uk.rs-online.com/web/p/products/8847264
C222 = GCM1887U1H103JA16J: as C113 on sheet EFR32BG13_Slave; Datasheet Link: https://psearch.en.murata.com/capacitor/product/GCM1887U1H103JA16%23.html; Height: 0.9mm; Manufacturer_Part_Number: GCM1887U1H103JA16J; Mouser Part Number: 81-GCM1887U1H103JA6J; Mouser Price/Stock: https://www.mouser.com/Search/Refine.aspx?Keyword=81-GCM1887U1H103JA6J
C223 = GRM1887U1A223JA01D: Capacitor; Manufacturer_Name: Murata Electronics; Datasheet Link: https://psearch.en.murata.com/capacitor/product/GRM1887U1A223JA01%23.html; Height: 0.9mm; Manufacturer_Part_Number: GRM1887U1A223JA01D; Mouser Part Number: 81-GRM1887U1A223JA1D; Mouser Price/Stock: https://www.mouser.com/Search/Refine.aspx?Keyword=81-GRM1887U1A223JA1D
IC5 = STPM34TR: Integrated Circuit; Manufacturer_Name: STMicroelectronics; Datasheet Link: http://www.st.com/content/ccc/resource/technical/document/datasheet/d9/c1/c6/3d/09/7f/4f/7b/DM00111861.pdf/files/DM00111861.pdf/jcr:content/translations/en.DM00111861.pdf; Height: 1mm; Manufacturer_Part_Number: STPM34TR; Mouser Part Number: 511-STPM34TR; Mouser Price/Stock: https://www.mouser.com/Search/Refine.aspx?Keyword=511-STPM34TR
IC6 = FOD8012AR2: Integrated Circuit; Manufacturer_Name: Fairchild Semiconductor; Datasheet Link: https://www.onsemi.com/pub/Collateral/FOD8012A-D.pdf; Height: 3.63mm; Manufacturer_Part_Number: FOD8012AR2; Mouser Part Number: 512-FOD8012AR2; Mouser Price/Stock: https://www.mouser.com/Search/Refine.aspx?Keyword=512-FOD8012AR2
IC7 IC8 = FOD8001: Integrated Circuit; Manufacturer_Name: Fairchild Semiconductor; Datasheet Link: https://www.mouser.com/ds/2/308/FOD8001-1124391.pdf; Height: 3.63mm; Manufacturer_Part_Number: FOD8001; Mouser Part Number: 512-FOD8001; Mouser Price/Stock: https://www.mouser.com/Search/Refine.aspx?Keyword=512-FOD8001
J6 = 87898-0306: Connector; Manufacturer_Name: Molex; Allied_Number: 71465806; Datasheet Link: http://www.molex.com/pdm_docs/sd/878980306_sd.pdf; Height: 10.81mm; Manufacturer_Part_Number: 87898-0306; Mouser Part Number: 538-87898-0306; Mouser Price/Stock: https://www.mouser.com/Search/Refine.aspx?Keyword=538-87898-0306; Allied Price/Stock: https://www.alliedelec.com/molexincorporated-87898-0306/71465806/
J7 J8 = 691508110302: as J3 on sheet PowerManagementSlave; Manufacturer_Part_Number: 691508110302; Datasheet Link: https://www.mouser.com/datasheet/2/445/6915081103xx-469297.pdf; Mouser Part Number: 710-691508110302; Value: *
PS1 = IRM-03-3.3S: Power Supply; Manufacturer_Name: Mean Well; Datasheet Link: https://www.meanwell.com/Upload/PDF/IRM-03/IRM-03-SPEC.PDF; Height: 16mm; Mouser Part Number: 709-IRM03-3.3S; Mouser Price/Stock: https://www.mouser.com/Search/Refine.aspx?Keyword=709-IRM03-3.3S; Manufacturer_Part_Number: IRM-03-3.3S
R201 = MCT06030C1004FP500: Resistor; Manufacturer_Name: Vishay; Datasheet Link: http://www.vishay.com/docs/28705/mcx0x0xpro.pdf; Height: 0.55mm; Manufacturer_Part_Number: MCT06030C1004FP500; Mouser Part Number: 594-MCT06030C1004FP5; Mouser Price/Stock: https://www.mouser.com/Search/Refine.aspx?Keyword=594-MCT06030C1004FP5
R202 = CRCW12060000Z0EAC: Resistor; Manufacturer_Name: Vishay; Datasheet Link: http://componentsearchengine.com/Datasheets/1/CRCW12060000Z0EAC.pdf; Height: 0.6mm; Manufacturer_Part_Number: CRCW12060000Z0EAC; Mouser Part Number: 71-CRCW12060000Z0EAC; Mouser Price/Stock: https://www.mouser.com/Search/Refine.aspx?Keyword=71-CRCW12060000Z0EAC
R203-R206 = MCT0603MD1002BP500: Resistor; Manufacturer_Name: Vishay; Datasheet Link: http://www.vishay.com/docs/28705/mcx0x0xpro.pdf; Height: 0.55mm; Manufacturer_Part_Number: MCT0603MD1002BP500; Mouser Part Number: 594-MCT0603MD1002BP5; Mouser Price/Stock: https://www.mouser.com/Search/Refine.aspx?Keyword=594-MCT0603MD1002BP5
R207 R208 = MCT0603PD1001DP500: Resistor; Manufacturer_Name: Vishay; Datasheet Link: http://www.vishay.com/docs/28705/mcx0x0xpro.pdf; Height: 0.55mm; Manufacturer_Part_Number: MCT0603PD1001DP500; Mouser Part Number: 594-MCT0603PD1001DP5; Mouser Price/Stock: https://www.mouser.com/Search/Refine.aspx?Keyword=594-MCT0603PD1001DP5
R209 = CPF0603B5R9E1: Resistor; Manufacturer_Name: TE Connectivity; Datasheet Link: http://www.farnell.com/datasheets/1786775.pdf; Height: 0.55mm; Manufacturer_Part_Number: CPF0603B5R9E1; Mouser Part Number: 279-CPF0603B5R9E1; RS Part Number: 1235327; RS Price/Stock: https://uk.rs-online.com/web/p/products/1235327
R210-R212 = MCT06030C2703FP500: Resistor; Manufacturer_Name: Vishay; Datasheet Link: http://www.vishay.com/docs/28705/mcx0x0xpro.pdf; Height: 0.55mm; Manufacturer_Part_Number: MCT06030C2703FP500; Mouser Part Number: 594-MCT06030C2703FP5; Mouser Price/Stock: https://www.mouser.com/Search/Refine.aspx?Keyword=594-MCT06030C2703FP5
R213 = ERA-3APB471V: Resistor; Manufacturer_Name: Panasonic; Allied_Number: 70360364; Datasheet Link: https://industrial.panasonic.com/cdbs/www-data/pdf/RDM0000/AOA0000C307.pdf; Height: 0.55mm; Manufacturer_Part_Number: ERA-3APB471V; Mouser Part Number: 667-ERA-3APB471V; Mouser Price/Stock: https://www.mouser.com/Search/Refine.aspx?Keyword=667-ERA-3APB471V; Allied Price/Stock: https://www.alliedelec.com/panasonic-era3apb471v/70360364/
Y201 = ECS-160-8-36B-CKY-TR: Crystal or Oscillator; Manufacturer_Name: ECS; Datasheet Link: https://ecsxtal.com/store/pdf/ECX-2236B.pdf; Height: 0mm; Manufacturer_Part_Number: ECS-160-8-36B-CKY-TR; Mouser Part Number: 520-160-8-36B-CKYT; Mouser Price/Stock: https://www.mouser.com/Search/Refine.aspx?Keyword=520-160-8-36B-CKYT

## Nets that join several sheets
BGND: EFR32BG13_Slave (29 pins), PowerManagementSlave (19 pins), STPM34Energy_measurement (6 pins)
IOVDD: EFR32BG13_Slave (9 pins), STPM34Energy_measurement (6 pins)
NetC33_2: EFR32BG13_Slave (C147.2 C148.2 C149.2 R104.1), PowerManagementSlave (C33.2 L2.2 R35.2)
PA2: EFR32BG13_Slave (IC1.27 J103.1), STPM34Energy_measurement (IC6.6)
PA3: EFR32BG13_Slave (IC1.28 J103.2), STPM34Energy_measurement (IC6.7)
PA4: EFR32BG13_Slave (IC1.29 J103.3), STPM34Energy_measurement (IC7.2)
PA5: EFR32BG13_Slave (IC1.30 J103.4), STPM34Energy_measurement (IC8.2)